# Altium schematic sheet PDM.SchDoc
size 297 x 209 mm; SheetNumber: 2; SheetTotal: 11
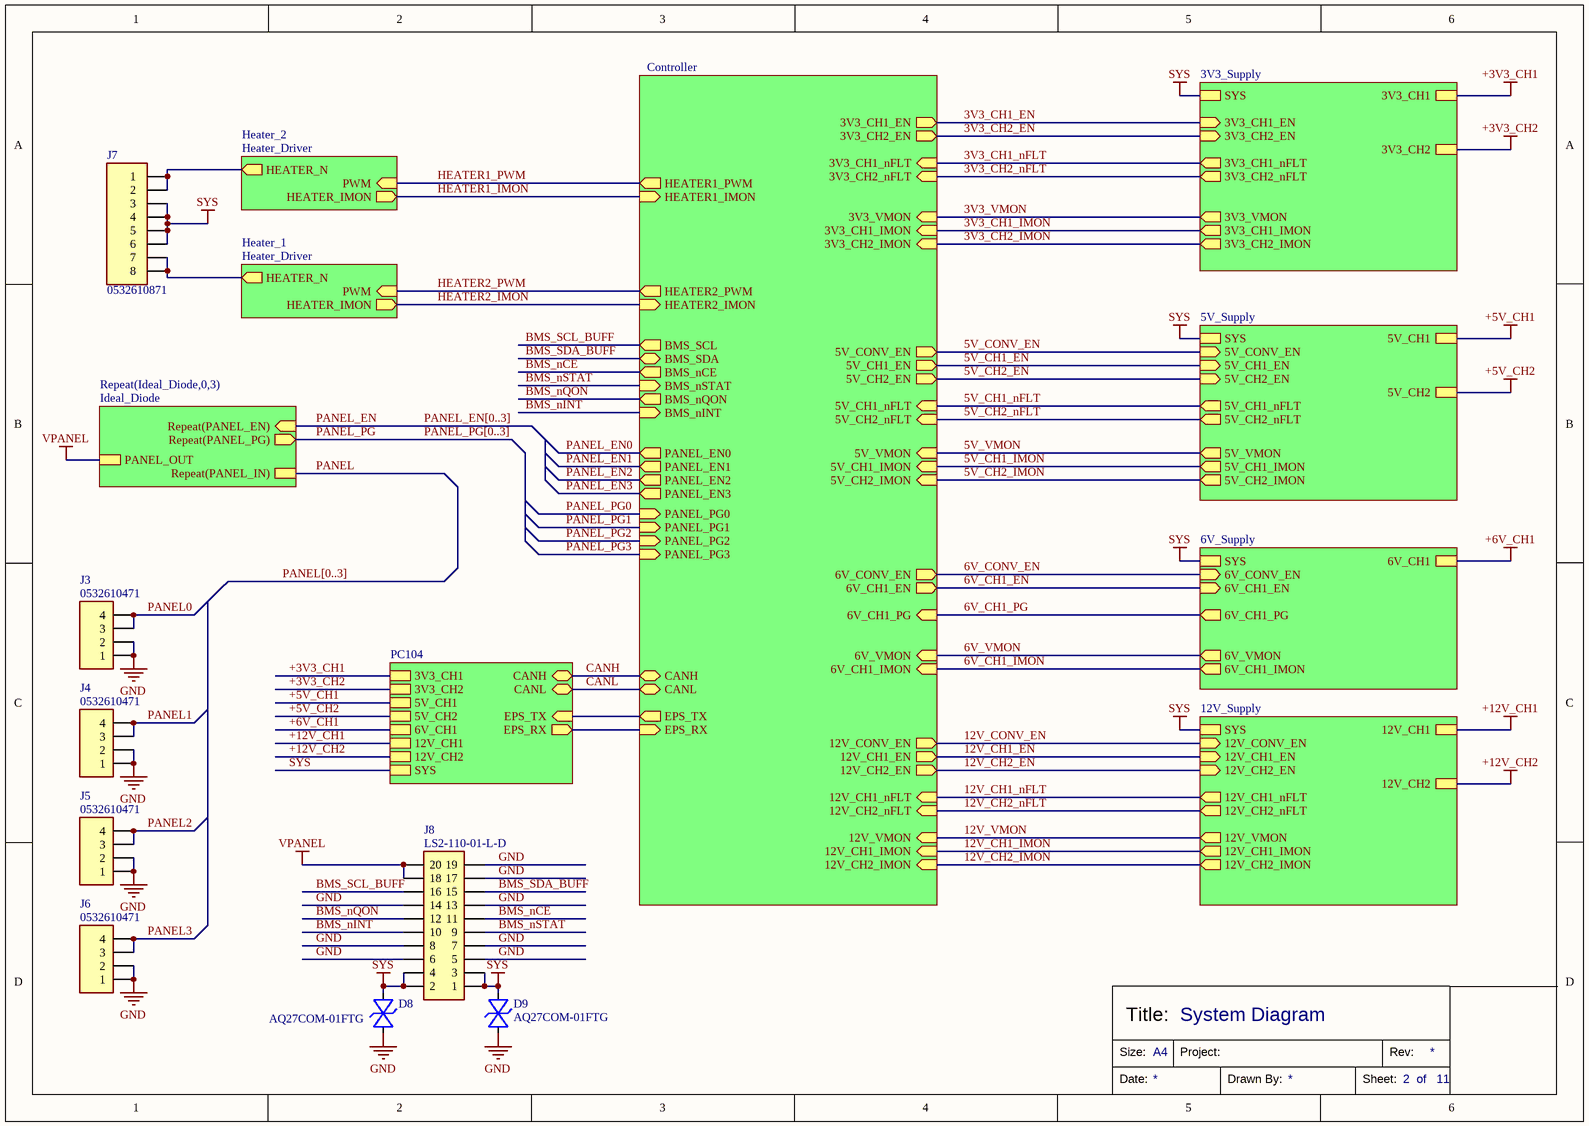
[diagram p0: PDM.SchDoc]

## Parts
D8  AQ27COM-01FTG  [SOD-323]
D9  AQ27COM-01FTG  [SOD-323]
J3  0532610471  [0532610471]
J4  0532610471  [0532610471]
J5  0532610471  [0532610471]
J6  0532610471  [0532610471]
J7  0532610871  [0532610871]
J8  LS2-110-01-L-D  [LS2-110-01-L-D]

## Sub-sheets
3V3_Supply = 3V3_Supply: SYS, 3V3_CH1, 3V3_CH2, 3V3_CH1_EN (in), 3V3_CH2_EN (in), 3V3_CH1_nFLT (out), 3V3_CH2_nFLT (out), 3V3_VMON (out), 3V3_CH1_IMON (out), 3V3_CH2_IMON (out)
5V5_Supply = 6V_Supply: SYS, 6V_CH1, 6V_CONV_EN (in), 6V_CH1_EN (in), 6V_CH1_PG (out), 6V_VMON (out), 6V_CH1_IMON (out)
5V_Supply = 5V_Supply: SYS, 5V_CH1, 5V_CH2, 5V_CONV_EN (in), 5V_CH1_EN (in), 5V_CH2_EN (in), 5V_CH1_nFLT (out), 5V_CH2_nFLT (out), 5V_VMON (out), 5V_CH1_IMON (out), 5V_CH2_IMON (out)
12V_Supply = 12V_Supply: SYS, 12V_CH1, 12V_CH2, 12V_CONV_EN (in), 12V_CH1_EN (in), 12V_CH2_EN (in), 12V_CH1_nFLT (out), 12V_CH2_nFLT (out), 12V_VMON (out), 12V_CH1_IMON (out), 12V_CH2_IMON (out)
Controller = Controller: HEATER1_PWM (out), HEATER1_IMON (in), HEATER2_PWM (out), HEATER2_IMON (in), PANEL_EN3 (out), PANEL_EN2 (out), PANEL_EN1 (out), PANEL_EN0 (out), PANEL_PG0 (in), PANEL_PG1 (in), PANEL_PG2 (in), PANEL_PG3 (in), 3V3_CH1_EN (out), 3V3_CH2_EN (out), 3V3_CH1_nFLT (in), 3V3_CH2_nFLT (in), 3V3_VMON (in), 3V3_CH1_IMON (in), 3V3_CH2_IMON (in), 5V_CONV_EN (out), 5V_CH1_EN (out), 5V_CH2_EN (out), 5V_CH1_nFLT (in), 5V_CH2_nFLT (in), 5V_CH1_IMON (in), 5V_CH2_IMON (in), 6V_CONV_EN (out), 6V_CH1_EN (out), 6V_CH1_PG (in), 6V_VMON (in), 12V_CONV_EN (out), 12V_CH1_EN (out), 12V_CH2_EN (out), 12V_CH1_nFLT (in), 12V_CH2_nFLT (in), 12V_VMON (in), 12V_CH1_IMON (in), 12V_CH2_IMON (in), 5V_VMON (in), 6V_CH1_IMON (in), BMS_SCL (out), BMS_SDA (bidir), BMS_nSTAT (in), BMS_nCE (out), BMS_nQON (out), BMS_nINT (in), CANH (bidir), CANL (bidir), EPS_TX (out), EPS_RX (in)
Heater_1 = Heater_Driver: HEATER_N (out), PWM (in), HEATER_IMON (out)
Heater_2 = Heater_Driver: HEATER_N (out), PWM (in), HEATER_IMON (out)
PC104 = PC104: 3V3_CH1, 3V3_CH2, 5V_CH1, 5V_CH2, 6V_CH1, 12V_CH1, 12V_CH2, CANH (bidir), CANL (bidir), SYS, EPS_TX (in), EPS_RX (out)
Repeat(Ideal_Diode,0,3) = Ideal_Diode: Repeat(PANEL_IN), Repeat(PANEL_EN) (in), Repeat(PANEL_PG) (out), PANEL_OUT

## Nets
+3V3_CH1: sheet 3V3_Supply/3V3_CH1, sheet PC104/3V3_CH1
+3V3_CH2: sheet 3V3_Supply/3V3_CH2, sheet PC104/3V3_CH2
+5V_CH1: sheet 5V_Supply/5V_CH1, sheet PC104/5V_CH1
+5V_CH2: sheet 5V_Supply/5V_CH2, sheet PC104/5V_CH2
+6V_CH1: sheet 5V5_Supply/6V_CH1, sheet PC104/6V_CH1
+12V_CH1: sheet 12V_Supply/12V_CH1, sheet PC104/12V_CH1
+12V_CH2: sheet 12V_Supply/12V_CH2, sheet PC104/12V_CH2
GND: D8.A D9.A J3.1 J3.2 J4.1 J4.2 J5.1 J5.2 J6.1 J6.2 J8.5 J8.6 J8.7 J8.8 J8.13 J8.14 J8.17 J8.19
SYS: D8.K D9.K J7.3 J7.4 J7.5 J7.6 J8.1 J8.2 J8.3 J8.4 ; sheet 12V_Supply/SYS, sheet 3V3_Supply/SYS, sheet 5V5_Supply/SYS, sheet 5V_Supply/SYS, sheet PC104/SYS
VPANEL: J8.18 J8.20 ; sheet Repeat(Ideal_Diode,0,3)/PANEL_OUT
3V3_CH1_EN: sheet Controller/3V3_CH1_EN, sheet 3V3_Supply/3V3_CH1_EN
3V3_CH1_IMON: sheet Controller/3V3_CH1_IMON, sheet 3V3_Supply/3V3_CH1_IMON
3V3_CH1_nFLT: sheet Controller/3V3_CH1_nFLT, sheet 3V3_Supply/3V3_CH1_nFLT
3V3_CH2_EN: sheet Controller/3V3_CH2_EN, sheet 3V3_Supply/3V3_CH2_EN
3V3_CH2_IMON: sheet Controller/3V3_CH2_IMON, sheet 3V3_Supply/3V3_CH2_IMON
3V3_CH2_nFLT: sheet Controller/3V3_CH2_nFLT, sheet 3V3_Supply/3V3_CH2_nFLT
3V3_VMON: sheet Controller/3V3_VMON, sheet 3V3_Supply/3V3_VMON
5V_CH1_EN: sheet Controller/5V_CH1_EN, sheet 5V_Supply/5V_CH1_EN
5V_CH1_IMON: sheet Controller/5V_CH1_IMON, sheet 5V_Supply/5V_CH1_IMON
5V_CH1_nFLT: sheet Controller/5V_CH1_nFLT, sheet 5V_Supply/5V_CH1_nFLT
5V_CH2_EN: sheet Controller/5V_CH2_EN, sheet 5V_Supply/5V_CH2_EN
5V_CH2_IMON: sheet Controller/5V_CH2_IMON, sheet 5V_Supply/5V_CH2_IMON
5V_CH2_nFLT: sheet Controller/5V_CH2_nFLT, sheet 5V_Supply/5V_CH2_nFLT
5V_CONV_EN: sheet Controller/5V_CONV_EN, sheet 5V_Supply/5V_CONV_EN
5V_VMON: sheet Controller/5V_VMON, sheet 5V_Supply/5V_VMON
6V_CH1_EN: sheet Controller/6V_CH1_EN, sheet 5V5_Supply/6V_CH1_EN
6V_CH1_IMON: sheet Controller/6V_CH1_IMON, sheet 5V5_Supply/6V_CH1_IMON
6V_CH1_PG: sheet Controller/6V_CH1_PG, sheet 5V5_Supply/6V_CH1_PG
6V_CONV_EN: sheet Controller/6V_CONV_EN, sheet 5V5_Supply/6V_CONV_EN
6V_VMON: sheet Controller/6V_VMON, sheet 5V5_Supply/6V_VMON
12V_CH1_EN: sheet Controller/12V_CH1_EN, sheet 12V_Supply/12V_CH1_EN
12V_CH1_IMON: sheet Controller/12V_CH1_IMON, sheet 12V_Supply/12V_CH1_IMON
12V_CH1_nFLT: sheet Controller/12V_CH1_nFLT, sheet 12V_Supply/12V_CH1_nFLT
12V_CH2_EN: sheet Controller/12V_CH2_EN, sheet 12V_Supply/12V_CH2_EN
12V_CH2_IMON: sheet Controller/12V_CH2_IMON, sheet 12V_Supply/12V_CH2_IMON
12V_CH2_nFLT: sheet Controller/12V_CH2_nFLT, sheet 12V_Supply/12V_CH2_nFLT
12V_CONV_EN: sheet Controller/12V_CONV_EN, sheet 12V_Supply/12V_CONV_EN
12V_VMON: sheet Controller/12V_VMON, sheet 12V_Supply/12V_VMON
BMS_nCE: J8.11 ; sheet Controller/BMS_nCE
BMS_nINT: J8.10 ; sheet Controller/BMS_nINT
BMS_nQON: J8.12 ; sheet Controller/BMS_nQON
BMS_nSTAT: J8.9 ; sheet Controller/BMS_nSTAT
BMS_SCL_BUFF: J8.16 ; sheet Controller/BMS_SCL
BMS_SDA_BUFF: J8.15 ; sheet Controller/BMS_SDA
CANH: sheet Controller/CANH, sheet PC104/CANH
CANL: sheet Controller/CANL, sheet PC104/CANL
HEATER1_IMON: sheet Controller/HEATER1_IMON, sheet Heater_2/HEATER_IMON
HEATER1_PWM: sheet Controller/HEATER1_PWM, sheet Heater_2/PWM
HEATER2_IMON: sheet Controller/HEATER2_IMON, sheet Heater_1/HEATER_IMON
HEATER2_PWM: sheet Controller/HEATER2_PWM, sheet Heater_1/PWM
PANEL: sheet Repeat(Ideal_Diode,0,3)/Repeat(PANEL_IN)
PANEL0: J3.3 J3.4
PANEL1: J4.3 J4.4
PANEL2: J5.3 J5.4
PANEL3: J6.3 J6.4
PANEL_EN: sheet Repeat(Ideal_Diode,0,3)/Repeat(PANEL_EN)
PANEL_EN0: sheet Controller/PANEL_EN0
PANEL_EN1: sheet Controller/PANEL_EN1
PANEL_EN2: sheet Controller/PANEL_EN2
PANEL_EN3: sheet Controller/PANEL_EN3
PANEL_PG: sheet Repeat(Ideal_Diode,0,3)/Repeat(PANEL_PG)
PANEL_PG0: sheet Controller/PANEL_PG0
PANEL_PG1: sheet Controller/PANEL_PG1
PANEL_PG2: sheet Controller/PANEL_PG2
PANEL_PG3: sheet Controller/PANEL_PG3
NetJ7_1: J7.1 J7.2 ; sheet Heater_2/HEATER_N
NetJ7_7: J7.7 J7.8 ; sheet Heater_1/HEATER_N
(unnamed): sheet Controller/EPS_TX, sheet PC104/EPS_TX
(unnamed): sheet Controller/EPS_RX, sheet PC104/EPS_RX

## Buses and harness runs
bus PANEL[0..3]
bus PANEL_EN[0..3]
bus PANEL_PG[0..3]

## Notes on the sheet
- System Diagram
- Size:
- Title:
- A4
- Project:
- Rev:
- Date:
- Drawn By:
- Sheet:
- of

## Library data of the parts
D8 D9 = AQ27COM-01FTG: Transient Voltage Suppression Diodes - TVS 27V 4A 30kV 12pF SOD323 Diode Array; Clamping Voltage: 50V; Breakdown Voltage: 28V; Vesd: 32kV; Working Voltage: 27V; Ipp - Peak Pulse Current: 4A; Temperature Range: -40~150°C; Part Number: AQ27COM-01FTG; Distributor: Digikey; Distributor Part Number: 18-AQ27COM-01FTGCT-ND
J3-J6 = 0532610471: Connector Header Surface Mount, Right Angle 4 position 0.049" (1.25mm) Molex Picoblade; Number of Positions: 4; Max Current Per Contact: 1A; Part Number: 0532610471; Distributor: Digikey; Distributor Part Number: WM7622CT-ND; Number of Rows: 2
J7 = 0532610871: Connector Header Surface Mount, Right Angle 8 position 0.049" (1.25mm) Picoblade; Number of Positions: 8; Contact Current (Max): 1A; Material Flammability Rating: UL94 V-0; Part Number: 0532610871; Distributor Part Number: WM7624CT-ND; Distributor: Digikey
J8 = LS2-110-01-L-D: Connector Self Mating 20 Position , Non-Gendered, Hermaphroditic Through Hole Gold; Number of Positions: 20; Contact Rating: 3.2A; Voltage Rating: 475VAC; Part Number: LS2-110-01-L-D; Distributor Part Number: SAM9665-ND; Distributor: Digikey; Number of Rows: 2; Operating Temperature: -55C ~ 125C